# Altium schematic sheet Main.SchDoc
size A4; SheetNumber: 1; SheetTotal: 11
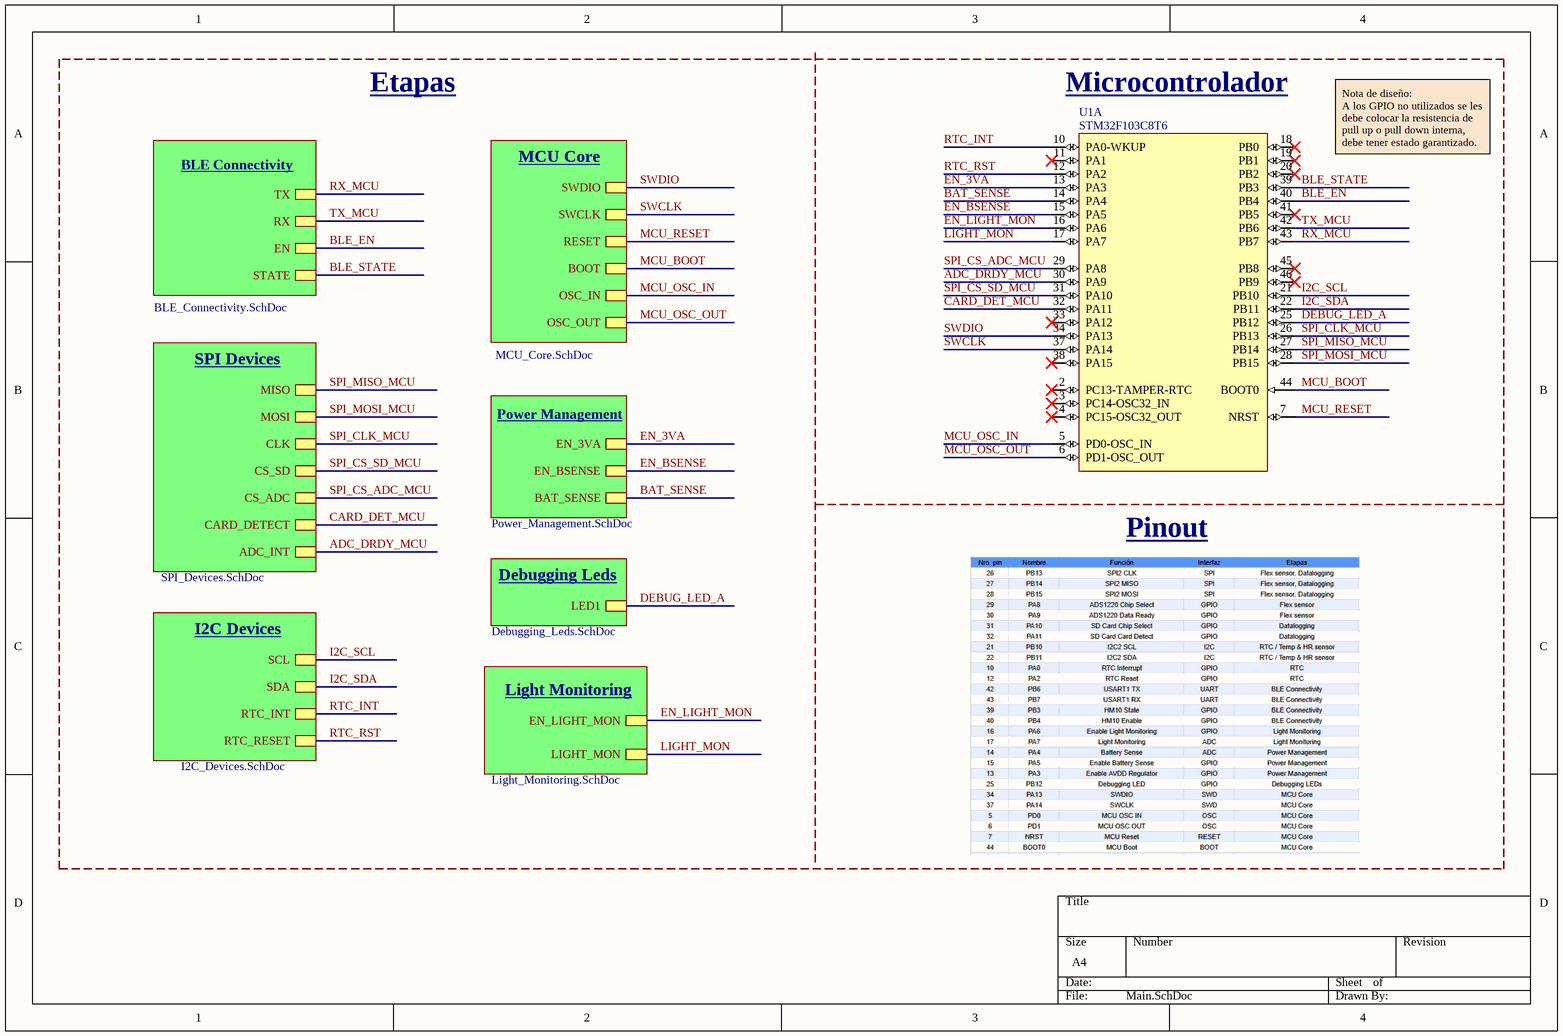
[diagram p0: Main.SchDoc]

## Parts
U1  STM32F103C8T6  [STM-LQFP48_L]  (part A of 2)

## Sub-sheets
BLE_Connectivity = BLE_Connectivity.SchDoc: TX, RX, EN, STATE  | Titulo: BLE Connectivity
Debugging_Leds = Debugging_Leds.SchDoc: LED1  | Titulo: Debugging Leds
I2C_Devices = I2C_Devices.SchDoc: SCL, SDA, RTC_INT, RTC_RESET  | Titulo: I2C Devices
Light_Monitoring = Light_Monitoring.SchDoc: EN_LIGHT_MON, LIGHT_MON  | Titulo: Light Monitoring
MCU_Core = MCU_Core.SchDoc: SWDIO, SWCLK, RESET, BOOT, OSC_IN, OSC_OUT  | Titulo: MCU Core
Power_Management = Power_Management.SchDoc: EN_3VA, BAT_SENSE, EN_BSENSE  | Titulo: Power Management
SPI_Devices = SPI_Devices.SchDoc: MISO, MOSI, CLK, CS_SD, CS_ADC, CARD_DETECT, ADC_INT  | Titulo: SPI Devices

## Nets
ADC_DRDY_MCU: U1.30(PA9) ; sheet SPI_Devices/ADC_INT
BAT_SENSE: U1.14(PA4) ; sheet Power_Management/BAT_SENSE
BLE_EN: U1.40(PB4) ; sheet BLE_Connectivity/EN
BLE_STATE: U1.39(PB3) ; sheet BLE_Connectivity/STATE
CARD_DET_MCU: U1.32(PA11) ; sheet SPI_Devices/CARD_DETECT
DEBUG_LED_A: U1.25(PB12) ; sheet Debugging_Leds/LED1
EN_3VA: U1.13(PA3) ; sheet Power_Management/EN_3VA
EN_BSENSE: U1.15(PA5) ; sheet Power_Management/EN_BSENSE
EN_LIGHT_MON: U1.16(PA6) ; sheet Light_Monitoring/EN_LIGHT_MON
I2C_SCL: U1.21(PB10) ; sheet I2C_Devices/SCL
I2C_SDA: U1.22(PB11) ; sheet I2C_Devices/SDA
LIGHT_MON: U1.17(PA7) ; sheet Light_Monitoring/LIGHT_MON
MCU_BOOT: U1.44(BOOT0) ; sheet MCU_Core/BOOT
MCU_OSC_IN: U1.5(PD0-OSC_IN) ; sheet MCU_Core/OSC_IN
MCU_OSC_OUT: U1.6(PD1-OSC_OUT) ; sheet MCU_Core/OSC_OUT
MCU_RESET: U1.7(NRST) ; sheet MCU_Core/RESET
RTC_INT: U1.10(PA0-WKUP) ; sheet I2C_Devices/RTC_INT
RTC_RST: U1.12(PA2) ; sheet I2C_Devices/RTC_RESET
RX_MCU: U1.43(PB7) ; sheet BLE_Connectivity/TX
SPI_CLK_MCU: U1.26(PB13) ; sheet SPI_Devices/CLK
SPI_CS_ADC_MCU: U1.29(PA8) ; sheet SPI_Devices/CS_ADC
SPI_CS_SD_MCU: U1.31(PA10) ; sheet SPI_Devices/CS_SD
SPI_MISO_MCU: U1.27(PB14) ; sheet SPI_Devices/MISO
SPI_MOSI_MCU: U1.28(PB15) ; sheet SPI_Devices/MOSI
SWCLK: U1.37(PA14) ; sheet MCU_Core/SWCLK
SWDIO: U1.34(PA13) ; sheet MCU_Core/SWDIO
TX_MCU: U1.42(PB6) ; sheet BLE_Connectivity/RX

Not connected (* = marked no-connect by the designer): U1 2(PC13-TAMPER-RTC)* 3(PC14-OSC32_IN)* 4(PC15-OSC32_OUT)* 11(PA1)* 18(PB0)* 19(PB1)* 20(PB2)* 33(PA12)* 38(PA15)* 41(PB5)* 45(PB8)* 46(PB9)*

## Notes on the sheet
- Etapas
- (near U1) Microcontrolador
- Nota de diseño:
  A los GPIO no utilizados se les debe colocar la resistencia de pull up o pull down interna, debe tener estado garantizado.
- Pinout

## Library data of the parts
U1 = STM32F103C8T6: ARM Cortex-M3 32-bit MCU, 64 KB Flash, 20 KB Internal RAM, 37 I/Os, 48-pin LQFP, -40 to 85 degC, Tray; Supply Voltage(Vcc) min (V): 2; Internal RAM Size (kB): 20; FLASH Size (Prog) (kB): 64; A/D Converter: 2x12-bit (10 Channel); I/Os (High Current): 37; Operating Frequency(F) (Processor speed) (MHz): 72; Core: ARM Cortex-M3; ComponentLink3Description: Package Specification; Mounting Technology: Surface Mount; PartNumber: STM32F103C8T6; PackageReference: LQFP48; Packing: Tray; ComponentLink3URL: http://www.st.com/st-web-ui/static/active/en/resource/technical/document/datasheet/DM00058181.pdf; DatasheetVersion: Rev. 16; ComponentLink1URL: http://www.st.com/web/en/home.html; PackageVersion: Rev. 6, 06/2013; ComponentLink2URL: http://www.st.com/st-web-ui/static/active/en/resource/technical/document/datasheet/CD00161566.pdf; ComponentLink1Description: Manufacturer URL; ComponentLink2Description: Datasheet; PackageDescription: 48-Pin Low Profile Quad Flat Package, 7 x 7 mm Body, 0.5 mm Pitch